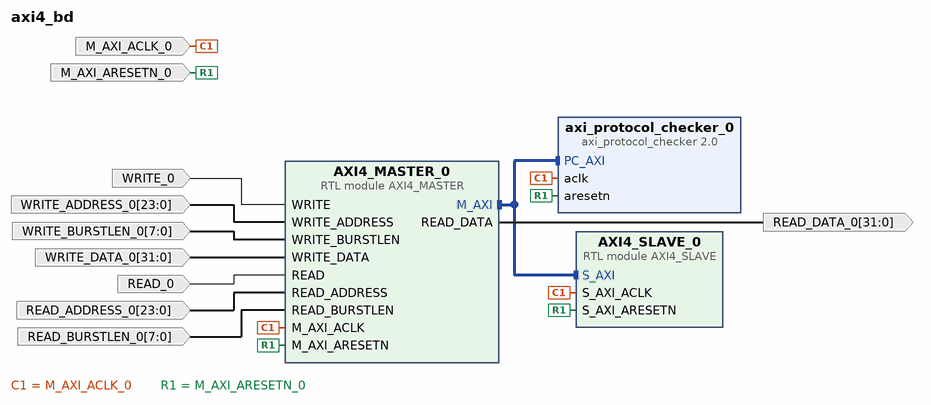
[diagram p0: block diagram of the top level]
# Vivado block design axi4_bd, xc7vx485tffg1157-1, Vivado 2019.1
create_bd_design axi4_bd

create_bd_port -dir I -type clk M_AXI_ACLK_0
create_bd_port -dir I -type rst M_AXI_ARESETN_0
create_bd_port -dir I WRITE_0
create_bd_port -dir I -from 23 -to 0 WRITE_ADDRESS_0
create_bd_port -dir I -from 7 -to 0 WRITE_BURSTLEN_0
create_bd_port -dir I -from 31 -to 0 WRITE_DATA_0
create_bd_port -dir I READ_0
create_bd_port -dir I -from 23 -to 0 READ_ADDRESS_0
create_bd_port -dir I -from 7 -to 0 READ_BURSTLEN_0
create_bd_port -dir O -from 31 -to 0 READ_DATA_0

create_bd_cell -type module -reference AXI4_SLAVE AXI4_SLAVE_0
create_bd_cell -type module -reference AXI4_MASTER AXI4_MASTER_0
create_bd_cell -type ip -vlnv xilinx.com:ip:axi_protocol_checker:2.0 axi_protocol_checker_0

# ---- connections ----

connect_bd_intf_net [get_bd_intf_pins AXI4_SLAVE_0/S_AXI] [get_bd_intf_pins AXI4_MASTER_0/M_AXI]
connect_bd_intf_net [get_bd_intf_pins AXI4_SLAVE_0/S_AXI] [get_bd_intf_pins axi_protocol_checker_0/PC_AXI]
connect_bd_net -net M_AXI_ACLK_0_1 [get_bd_ports M_AXI_ACLK_0] \
  [get_bd_pins AXI4_MASTER_0/M_AXI_ACLK] [get_bd_pins axi_protocol_checker_0/aclk] [get_bd_pins AXI4_SLAVE_0/S_AXI_ACLK]
connect_bd_net -net M_AXI_ARESETN_0_1 [get_bd_ports M_AXI_ARESETN_0] \
  [get_bd_pins AXI4_MASTER_0/M_AXI_ARESETN] [get_bd_pins axi_protocol_checker_0/aresetn] \
  [get_bd_pins AXI4_SLAVE_0/S_AXI_ARESETN]
connect_bd_net -net WRITE_0_1 [get_bd_ports WRITE_0] [get_bd_pins AXI4_MASTER_0/WRITE]
connect_bd_net -net WRITE_ADDRESS_0_1 [get_bd_ports WRITE_ADDRESS_0] [get_bd_pins AXI4_MASTER_0/WRITE_ADDRESS]
connect_bd_net -net WRITE_BURSTLEN_0_1 [get_bd_ports WRITE_BURSTLEN_0] [get_bd_pins AXI4_MASTER_0/WRITE_BURSTLEN]
connect_bd_net -net WRITE_DATA_0_1 [get_bd_ports WRITE_DATA_0] [get_bd_pins AXI4_MASTER_0/WRITE_DATA]
connect_bd_net -net READ_0_1 [get_bd_ports READ_0] [get_bd_pins AXI4_MASTER_0/READ]
connect_bd_net -net READ_ADDRESS_0_1 [get_bd_ports READ_ADDRESS_0] [get_bd_pins AXI4_MASTER_0/READ_ADDRESS]
connect_bd_net -net READ_BURSTLEN_0_1 [get_bd_ports READ_BURSTLEN_0] [get_bd_pins AXI4_MASTER_0/READ_BURSTLEN]
connect_bd_net [get_bd_pins AXI4_MASTER_0/READ_DATA] [get_bd_ports READ_DATA_0]

validate_bd_design
save_bd_design
